# Altium schematic sheet cereal-sys.SchDoc: Cereal Diagram
size Tabloid; CheckedBy: elerner, jmpenny; Author: dnv; DocumentNumber: N/A; Revision: 1; SheetNumber: 1; SheetTotal: 2
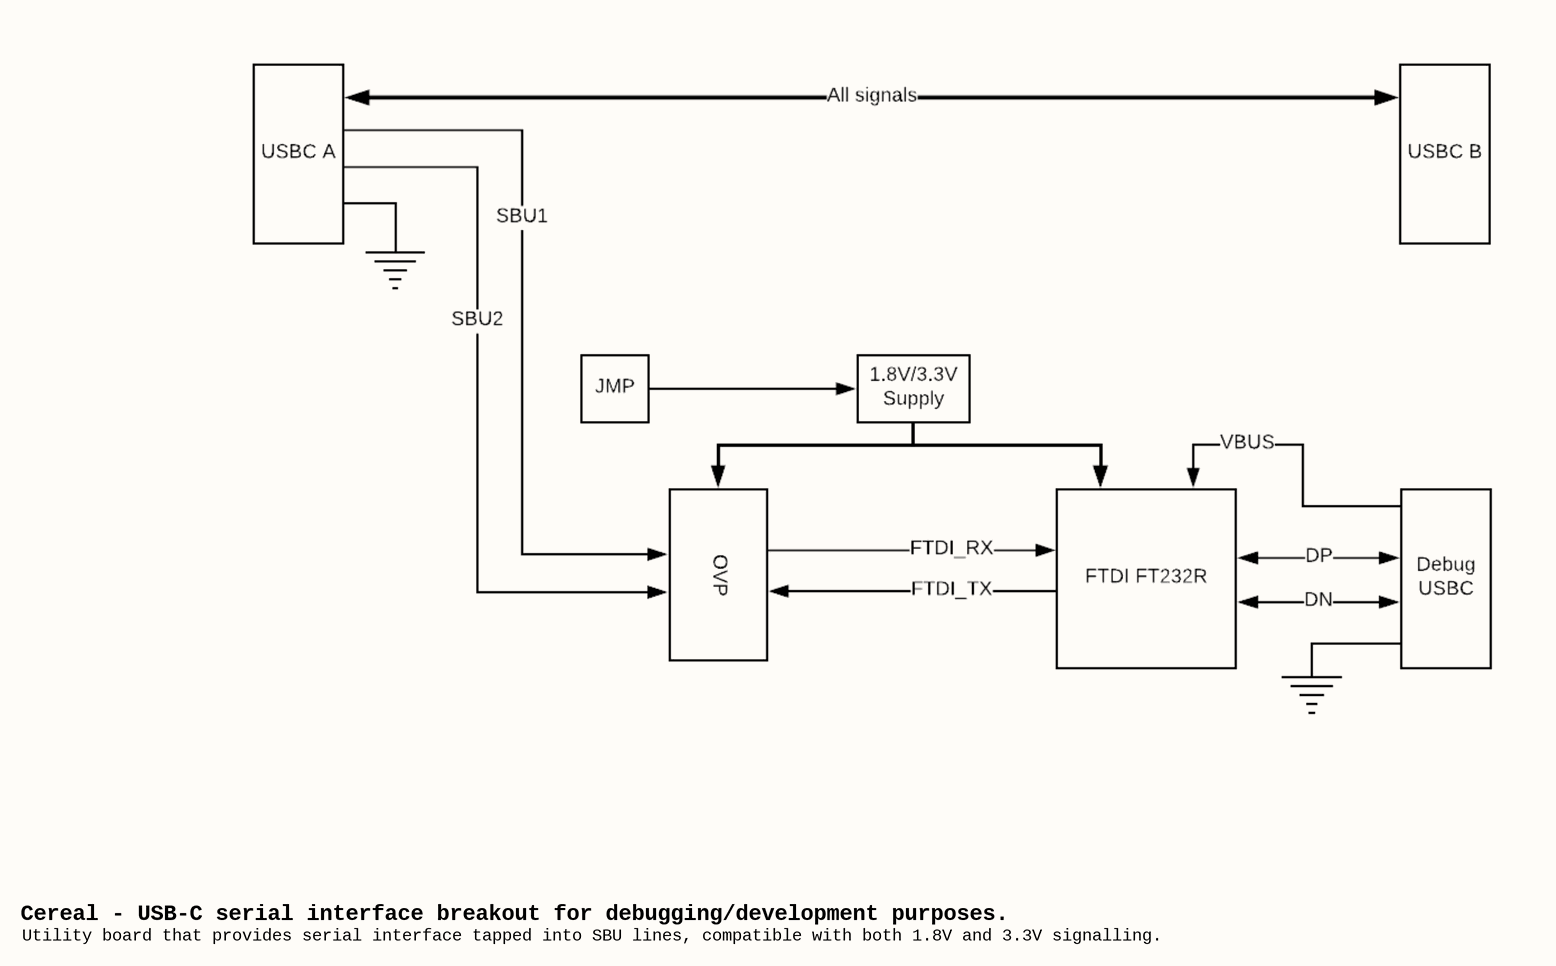
[diagram p0: cereal-sys.SchDoc]

## Notes on the sheet
- Cereal - USB-C serial interface breakout for debugging/development purposes.
- Utility board that provides serial interface tapped into SBU lines, compatible with both 1.8V and 3.3V signalling.
- GPN:
- Title:
- Revision:
- Size:
- Tabloid
- Author:
- Reviewers:
- Date:
- Time:
- Sheet
- of